# Altium schematic sheet 02_CMUT_RX.SchDoc
size A3; SheetNumber: 3; SheetTotal: 3
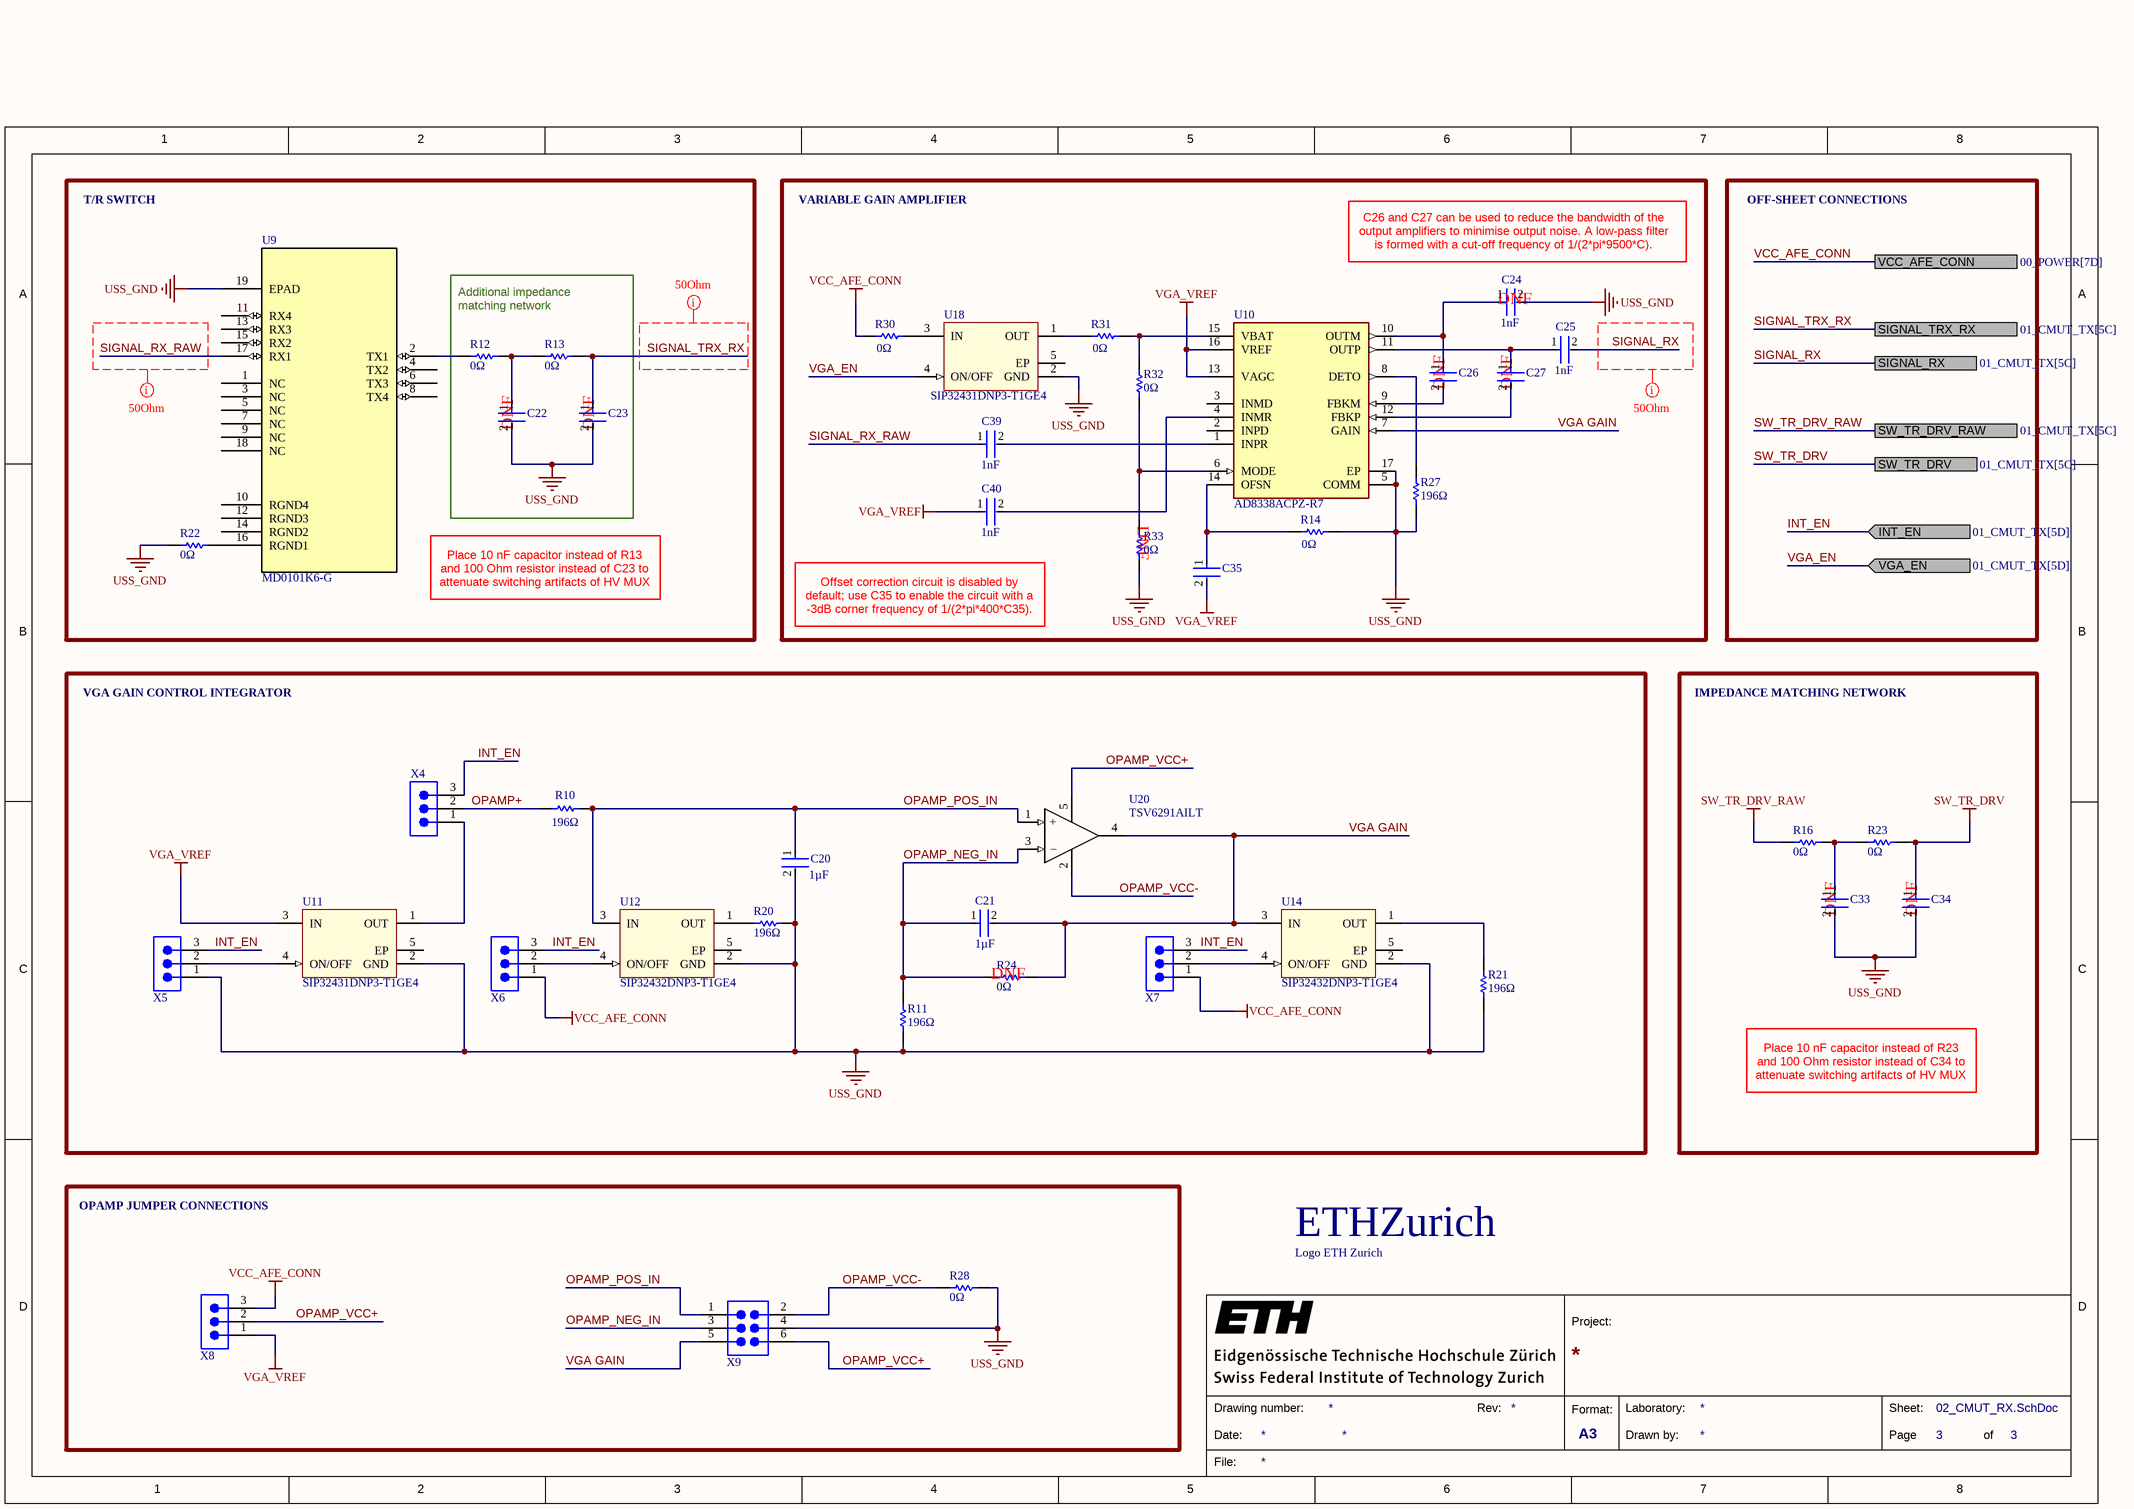
[diagram p0: 02_CMUT_RX.SchDoc]

## Parts
A1  Logo ETH Zurich  [eth-zurich_4mm]  (no BOM)
C20  Capacitance: 1µF  [FP-CGA3E-0_3-0_1-IPC_B]  (hidden comment: CGA3E3X5R1H105K)
C21  Capacitance: 1µF  [FP-CGA3E-0_3-0_1-IPC_B]  (hidden comment: CGA3E3X5R1H105K)
C22  CGA3E3X5R1H105K  [FP-CGA3E-0_3-0_1-IPC_B]  (value not drawn)
C23  CGA3E3X5R1H105K  [FP-CGA3E-0_3-0_1-IPC_B]  (value not drawn)
C24  Capacitance: 1nF  [FP-CGA3E-0_3-0_1-IPC_A]  (hidden comment: TDK CGA3E2X5R1H102K080AA)
C25  Capacitance: 1nF  [FP-CGA3E-0_3-0_1-IPC_A]  (hidden comment: TDK CGA3E2X5R1H102K080AA)
C26  CGA3E3X5R1H105K  [FP-CGA3E-0_3-0_1-IPC_B]  (value not drawn)
C27  CGA3E3X5R1H105K  [FP-CGA3E-0_3-0_1-IPC_B]  (value not drawn)
C33  CGA3E3X5R1H105K  [FP-CGA3E-0_3-0_1-IPC_B]  (value not drawn)
C34  CGA3E3X5R1H105K  [FP-CGA3E-0_3-0_1-IPC_B]  (value not drawn)
C35  CGA3E3X5R1H105K  [FP-CGA3E-0_3-0_1-IPC_B]  (value not drawn)
C39  Capacitance: 1nF  [FP-CGA3E-0_3-0_1-IPC_A]  (hidden comment: TDK CGA3E2X5R1H102K080AA)
C40  Capacitance: 1nF  [FP-CGA3E-0_3-0_1-IPC_A]  (hidden comment: TDK CGA3E2X5R1H102K080AA)
R10  Resistance: 196Ω  [RESC1608X55X25NL10T15]  (hidden comment: RC0603FR-07196RL)
R11  Resistance: 196Ω  [RESC1608X55X25NL10T15]  (hidden comment: RC0603FR-07196RL)
R12  Resistance: 0Ω  [RESC1608X55X25NL10T15]  (hidden comment: RC0603JR-130RL)
R13  Resistance: 0Ω  [RESC1608X55X25NL10T15]  (hidden comment: RC0603JR-130RL)
R14  Resistance: 0Ω  [RESC1608X55X25NL10T15]  (hidden comment: RC0603JR-130RL)
R16  Resistance: 0Ω  [RESC1608X55X25NL10T15]  (hidden comment: RC0603JR-130RL)
R20  Resistance: 196Ω  [RESC1608X55X25NL10T15]  (hidden comment: RC0603FR-07196RL)
R21  Resistance: 196Ω  [RESC1608X55X25NL10T15]  (hidden comment: RC0603FR-07196RL)
R22  Resistance: 0Ω  [RESC1608X55X25NL10T15]  (hidden comment: RC0603JR-130RL)
R23  Resistance: 0Ω  [RESC1608X55X25NL10T15]  (hidden comment: RC0603JR-130RL)
R24  Resistance: 0Ω  [RESC1608X55X25NL10T15]  (hidden comment: RC0603JR-130RL)
R27  Resistance: 196Ω  [RESC1608X55X25NL10T15]  (hidden comment: RC0603FR-07196RL)
R28  Resistance: 0Ω  [RESC1608X55X25NL10T15]  (hidden comment: RC0603JR-130RL)
R30  Resistance: 0Ω  [RESC1608X55X25NL10T15]  (hidden comment: RC0603JR-130RL)
R31  Resistance: 0Ω  [RESC1608X55X25NL10T15]  (hidden comment: RC0603JR-130RL)
R32  Resistance: 0Ω  [RESC1608X55X25NL10T15]  (hidden comment: RC0603JR-130RL)
R33  Resistance: 0Ω  [RESC1608X55X25NL10T15]  (hidden comment: RC0603JR-130RL)
U9  MD0101K6-G  [DFN18_5X5_MCH]
U10  AD8338ACPZ-R7  [FP-CP-16-22-IPC_C]
U11  SIP32431DNP3-T1GE4  [TDFN-4_V]
U12  SIP32432DNP3-T1GE4  [TDFN-4_V]
U14  SIP32432DNP3-T1GE4  [TDFN-4_V]
U18  SIP32431DNP3-T1GE4  [TDFN-4_V]
U20  TSV6291AILT  [SOT95P280X145-5N]
X4  68000-103HLF  [68000-103HLF]  (value not drawn)
X5  68000-103HLF  [68000-103HLF]  (value not drawn)
X6  68000-103HLF  [68000-103HLF]  (value not drawn)
X7  68000-103HLF  [68000-103HLF]  (value not drawn)
X8  68000-103HLF  [68000-103HLF]  (value not drawn)
X9  67996-106HLF  [67996-106HLF]  (value not drawn)

## Blocks framed on the sheet
DNF: C20 C21 R10 R11 R20 R21 R24 U11 U12 U14 U20 X4-X7
OPAMP JUMPER CONNECTIONS: R28 X8 X9

## Ports
INT_EN (in, see 01_CMUT_TX[5D]), SIGNAL_RX (see 01_CMUT_TX[5C]), SIGNAL_TRX_RX (see 01_CMUT_TX[5C]), SW_TR_DRV (see 01_CMUT_TX[5C]), SW_TR_DRV_RAW (see 01_CMUT_TX[5C]), VCC_AFE_CONN (see 00_POWER[7D]), VGA_EN (in, see 01_CMUT_TX[5D])

## Nets
SW_TR_DRV: C34.1 R23.1 ; port SW_TR_DRV
SW_TR_DRV_RAW: R16.2 ; port SW_TR_DRV_RAW
USS_GND: C20.2 C22.2 C23.2 C24.2 C33.2 C34.2 R11.1 R14.1 R20.1 R21.2 R22.2 R27.2 R28.2 R33.2 U9.19(EPAD) U10.5(COMM) U10.17(EP) U11.2(GND) U12.2(GND) U14.2(GND) U18.2(GND) X5.1 X9.4
VCC_AFE_CONN: R30.2 X6.1 X7.1 X8.3 ; port VCC_AFE_CONN
VGA_VREF: C35.2 C40.1 U10.13(VAGC) U10.16(VREF) U11.3(IN) X8.1
INT_EN: X4.3 X5.3 X6.3 X7.3 ; port INT_EN
OPAMP+: R10.1 X4.2
OPAMP_NEG_IN: C21.1 R11.2 R24.2 U20.3 X9.3
OPAMP_POS_IN: C20.1 R10.2 U12.3(IN) U20.1 X9.1
OPAMP_VCC+: U20.5 X8.2 X9.6
OPAMP_VCC-: R28.1 U20.2 X9.2
SIGNAL_RX: C25.2 ; port SIGNAL_RX
SIGNAL_RX_RAW: C39.1 U9.17(RX1)
SIGNAL_TRX_RX: C23.1 R13.1 ; port SIGNAL_TRX_RX
VGA GAIN: C21.2 R24.1 U10.7(GAIN) U14.3(IN) U20.4 X9.5
VGA_EN: U18.4(ON/OFF) ; port VGA_EN
NetC22_1: C22.1 R12.1 R13.2
NetC24_1: C24.1 C26.1 U10.10(OUTM)
NetC25_1: C25.1 C27.1 U10.11(OUTP)
NetC26_2: C26.2 U10.9(FBKM)
NetC27_2: C27.2 U10.12(FBKP)
NetC33_1: C33.1 R16.1 R23.2
NetC35_1: C35.1 R14.2 U10.14(OFSN)
NetC39_2: C39.2 U10.1(INPR)
NetC40_2: C40.2 U10.4(INMR)
NetR12_2: R12.2 U9.2(TX1)
NetR20_2: R20.2 U12.1(OUT)
NetR21_1: R21.1 U14.1(OUT)
NetR22_1: R22.1 U9.16(RGND1)
NetR27_1: R27.1 U10.8(DETO)
NetR30_1: R30.1 U18.3(IN)
NetR31_1: R31.1 R32.1 U10.15(VBAT)
NetR31_2: R31.2 U18.1(OUT)
NetR32_2: R32.2 R33.1 U10.6(MODE)
NetU11_1: U11.1(OUT) X4.1
NetU11_4: U11.4(ON/OFF) X5.2
NetU12_4: U12.4(ON/OFF) X6.2
NetU14_4: U14.4(ON/OFF) X7.2

Not connected (* = marked no-connect by the designer): U9 1(NC) 3(NC) 4(TX2) 5(NC) 6(TX3) 7(NC) 8(TX4) 9(NC) 10(RGND4) 11(RX4) 12(RGND3) 13(RX3) 14(RGND2) 15(RX2) 18(NC); U10 2(INPD) 3(INMD); U11 5(EP); U12 5(EP); U14 5(EP); U18 5(EP)

## Layout directives
net class *: SIGNAL_RX, SIGNAL_RX_RAW, SIGNAL_TRX_RX

## Notes on the sheet
- T/R SWITCH
- VARIABLE GAIN AMPLIFIER
- OFF-SHEET CONNECTIONS
- Additional impedance matching network
- (near C24) C26 and C27 can be used to reduce the bandwidth of the output amplifiers to minimise output noise. A low-pass filter is formed with a cut-off frequency of 1/(2*pi*9500*C).
- (near C24) DNF
- (near C22) DNF
- (near C23) DNF
- (near C26) DNF
- (near C27) DNF
- (near U9) Place 10 nF capacitor instead of R13 and 100 Ohm resistor instead of C23 to attenuate switching artifacts of HV MUX
- (near R33) DNF
- Offset correction circuit is disabled by default; use C35 to enable the circuit with a -3dB corner frequency of 1/(2*pi*400*C35).
- VGA GAIN CONTROL INTEGRATOR
- IMPEDANCE MATCHING NETWORK
- (near C33) DNF
- (near C34) DNF
- Place 10 nF capacitor instead of R23 and 100 Ohm resistor instead of C34 to attenuate switching artifacts of HV MUX
- 1
- 2
- 3
- 4
- 5
- 6
- 7
- 8
- A
- B
- C
- D
- Project:
- Date:
- Drawing number:
- Rev:
- Format:
- A3
- Drawn by:
- Laboratory:
- Page
- Sheet:
- of
- File:
- (in symbol CMP-00038-1) ETHZurich
- (in symbol TSV6291AILT) +; _

## Library data of the parts
A1 = CMP-00038-1
C20-C23 C26 C27 C33-C35 = CMP-08246-000317-1: Cap Ceramic 1uF 50V X5R 10% Pad SMD 0603 +85°C Automotive T/R; Termination: SMD/SMT; Tolerance: 10%; Case Code (Metric): 1608; Max Operating Temperature: 85°C; Case/Package: 0603; Voltage Rating: 50V; Dielectric: X5R; Case Code (Imperial): 0603; Packaging: Tape and Reel; Min Operating Temperature: -55°C; Voltage Rating (DC): 50V
  C22 C23 C26 C27 C33-C35: Capacitance: 1uF
C24 C25 C39 C40 = CMP-08246-002238-1: Cap Ceramic 1nF 50V X5R 10% Pad SMD 0603 +85°C Automotive T/R; Min Operating Temperature: -55°C; Packaging: Tape and Reel; Package Quantity: 4000; Case Code (Metric): 1608; Ratings: AEC-Q200; Height: 0.8mm; Case/Package: 0603; Width: 0.031inch; Voltage Rating (DC): 50V; Termination: SMD/SMT; Mount: Surface Mount; Case Code (Imperial): 0603; Max Operating Temperature: 85°C; Weight: 7.1E-05oz; Length: 0.063inch; Voltage Rating: 50V; Dielectric: X5R; Thickness: 0.035inch; Tolerance: 10%
R10 R11 R20 R21 R27 = CMP-2000-03929-1: Manufacturer: Yageo; Part Number: RC0603FR-07196RL
R12-R14 R16 R22-R24 R28 R30-R33 = CMP-2000-04311-1: Manufacturer: Yageo; Part Number: RC0603JR-130RL
U9 = MD0101K6-G: No Description Available; Mfr_Name: Microchip; Copyright: Copyright (C) 2022 Ultra Librarian. All rights reserved.; Manufacturer_Part_Number: MD0101K6-G; RefDes: RefDes; Type: DEV
U10 = CMP-09116-000032-1: IC OPAMP VGA 1 CIRCUIT 16LFCSP; Manufacturer: Analog Devices; Nominal Supply Current: 3-6mA; Max Supply Voltage: 5V; Number Of Channels: 1; Output Current Per Channel: 5mA; Max Junction Temp: +150°C; Min Supply Voltage: 3V; Bandwidth: 18MHz; Voltage Gain: 80dB; Mouser Description: Special Purpose Amplifiers Ultra Low Pwr 18MHz SGL CH VGA; Device Class L2: Linear ICs; Ipc Land Pattern Name: QFN50P300X300X75-16; Temperature Range Low: -40°C; Device Class L1: Integrated Circuits (ICs); RoHS: TRUE; Digikey Description: IC OPAMP VGA 1 CIRCUIT 16LFCSP; Category: IC; ComponentLink2URL: https://www.analog.com/media/en/technical-documentation/data-sheets/AD8338.pdf; Automotive: No; Height: 0.8mm; Manufacturer Part Number: AD8338ACPZ-R7; Octopart: https://octopart.com/ad8338acpz-r7-analog+devices-21054770; Temperature: -40°C to +85°C; ComponentLink2Description: Datasheet; Lead Free: Yes; Temperature Range High: +85°C; Package: CP-16-22; Device Class L3: Amplifiers - Op Amps
U11 U12 U14 U18 = CMP-00918-1: Power Switch ICs - Power Distribution 1A Slew Rate Ctrl Load Switch; Number of Outputs: 1; Max Power Dissipation: 324mW; Max Supply Voltage: 5.5V; Min Supply Voltage: 1.1V; Interface: On/Off; Max Output Current: 1.4A; On-State Resistance: 520mR; Turn-Off Delay Time: 10us; Turn-On Delay Time: 40us; Fault Protection: Reverse Current; Output Configuration: High Side; Mount: Surface Mount; Number of Pins: 4; Weight: 0.001764oz; Min Operating Temperature: -40°C; Max Operating Temperature: 85°C; Output Current: 1A; Packaging: Tape and Reel; Package Quantity: 3000; Power Dissipation: 324mW; Radiation Hardening: No; Lead Free: Lead Free
U20 = TSV6291AILT: TVS6291A Series 5.5 V 1.3 MHz Single CMOS Operational Amplifier - SOT-23-5
X4-X8 = CMP-00101-2: 3 Positions Header, Unshrouded Connector 0.100" (2.54mm) Through Hole Gold or Gold, GXT™; Manufacturer: Amphenol FCI; Current Rating: 3A; Insulation Resistance: 5GR; Number of Positions: 3; Max Voltage Rating (AC): 1.5kV; Termination: Solder; Fastening Type: -; Features: -; Contact Finish: Gold or Gold, GXT™; Contact Finish Thickness: 15µin (0.38µm); Color: Black; Supplier: Digikey; Supplier Part Number: 609-3461-ND; ComponentLink1Description: 68000-274283-5157301.pdf; ComponentLink1URL: https://datasheet.ciiva.com/5157/68000-274283-5157301.pdf; Depth: 2.41mm; Flammability Rating: UL94 V-0; Housing Colour: Black; Housing Material: Thermoplastic; Length: 7.62mm; Manufacturer Part Number: 68000-103HLF; Max Operating Temperature: 125°C; Packaging: Bulk; Contact Type: Male Pin; Connector Type: Header, Unshrouded; Pitch: 2.54mm; Number of Rows: 1; Contact Mating Length: 0.230" (5.84mm); Mounting Type: Through Hole; Min Operating Temperature: -65°C; Number of Contacts: 3; Orientation: Straight; Package Quantity: 100; Radiation Hardening: No; REACH SVHC: No SVHC; Termination Post Length: 2.41mm; Voltage Rating: 1.5kV; Contact Gender: Male; Contact Material: Bronze; Contact Plating: Nickel,Gold,GXT; ComponentLink2Description: 68000-731071.pdf; ComponentLink2URL: https://datasheet.ciiva.com/731/68000-731071.pdf; ComponentLink3Description: 68000-10149754.pdf; ComponentLink3URL: https://datasheet.ciiva.com/10149/68000-10149754.pdf; ComponentLink4Description: 1914865-46392021.pdf; ComponentLink4URL: https://datasheet.ciiva.com/46392/1914865-46392021.pdf
X9 = CMP-00150-2: 6 Positions Header, Unshrouded Connector 0.100" (2.54mm) Through Hole Gold or Gold, GXT™; Manufacturer: Amphenol FCI; Connector Type: Male Pin; Number of Positions: 6; Row Spacing: 0.1inch; Current Rating: 3A; Gender: Male; Insulation Resistance: 5GR; Mating Post Length: 5.84mm; Max Voltage Rating (AC): 1.5kV; Packaging: Bulk; Pitch: 2.54mm; Number of Rows: 2; Contact Mating Length: 0.23inch; Termination: Solder; Manufacturer Part Number: 67996-106HLF; Supplier: Digikey; Supplier Part Number: 609-3202-ND; ComponentLink1Description: 67996-16726269.pdf; ComponentLink1URL: https://datasheet.ciiva.com/16726/67996-16726269.pdf; Case/Package: 100; Colour: Black; ComponentLink2Description: 1876884-46393071.pdf; ComponentLink2URL: https://datasheet.ciiva.com/46393/1876884-46393071.pdf; ComponentLink3Description: 67996-728918.pdf; ComponentLink3URL: https://datasheet.ciiva.com/728/67996-728918.pdf; ComponentLink4Description: 67996-10149181.pdf; ComponentLink4URL: https://datasheet.ciiva.com/10149/67996-10149181.pdf; Contact Gender: Male; Contact Material: Bronze; Contact Plating: Nickel,Gold,GXT; Depth: 4.83mm; Flammability Rating: UL94 V-0; Housing Colour: Black; Housing Material: Thermoplastic; Length: 7.62mm; Max Operating Temperature: 125°C; Min Operating Temperature: -65°C; Number of Contacts: 6; Orientation: Straight; Package Quantity: 100; Radiation Hardening: No; REACH SVHC: No SVHC; Termination Post Length: 2.41mm; Voltage Rating: 1.5kV